# EAGLE design ledlamp (EAGLE 6.5.0)
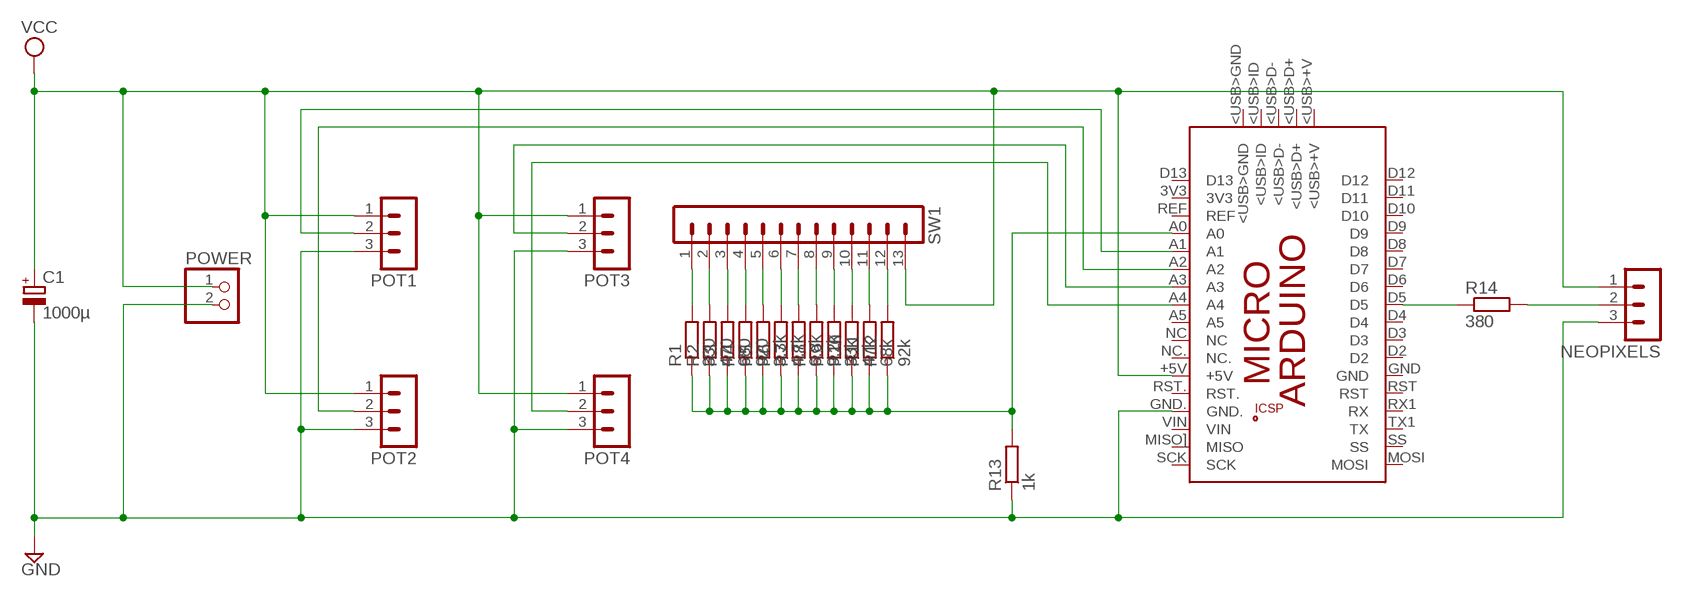
[diagram p0: schematic, sheet 1]

## Parts
C1  1000µ  CPOL-EUE5-8.5  [E5-8,5]
NEOPIXELS  MA03-1  [MA03-1]
PCB1  ARDUINO_MICRO  [ARDUINO_MICRO]
POT1  MA03-1  [MA03-1]
POT2  MA03-1  [MA03-1]
POT3  MA03-1  [MA03-1]
POT4  MA03-1  [MA03-1]
POWER  PINHD-1X2  [1X02]
R1  330  R-EU_0207/10  [0207/10]
R2  470  R-EU_0207/10  [0207/10]
R3  680  R-EU_0207/10  [0207/10]
R4  920  R-EU_0207/10  [0207/10]
R5  3.3k  R-EU_0207/10  [0207/10]
R6  4.7k  R-EU_0207/10  [0207/10]
R7  6.8k  R-EU_0207/10  [0207/10]
R8  9.2k  R-EU_0207/10  [0207/10]
R9  33k  R-EU_0207/10  [0207/10]
R10  47k  R-EU_0207/10  [0207/10]
R11  68k  R-EU_0207/10  [0207/10]
R12  92k  R-EU_0207/10  [0207/10]
R13  1k  R-EU_0207/10  [0207/10]
R14  380  R-EU_0207/10  [0207/10]
SW1  MA13-1  [MA13-1]

## Nets
GND: C1.- NEOPIXELS.3 PCB1.GND. POT1.3 POT2.3 POT3.3 POT4.3 POWER.2 R13.1
N$2: R1.2 SW1.1
N$3: R2.2 SW1.2
N$4: R3.2 SW1.3
N$5: R4.2 SW1.4
N$6: R5.2 SW1.5
N$7: R6.2 SW1.6
N$8: R7.2 SW1.7
N$9: R8.2 SW1.8
N$10: R9.2 SW1.9
N$11: R10.2 SW1.10
N$12: R11.2 SW1.11
N$13: R12.2 SW1.12
N$14: PCB1.A0 R1.1 R2.1 R3.1 R4.1 R5.1 R6.1 R7.1 R8.1 R9.1 R10.1 R11.1 R12.1 R13.2
N$18: PCB1.A1 POT1.2
N$19: PCB1.A2 POT2.2
N$20: PCB1.A3 POT3.2
N$21: PCB1.A4 POT4.2
N$22: PCB1.D5 R14.1
N$23: NEOPIXELS.2 R14.2
VCC: C1.+ NEOPIXELS.1 PCB1.+5V POT1.1 POT2.1 POT3.1 POT4.1 POWER.1 SW1.13
Unconnected: PCB1.3V3 PCB1.5V PCB1.<USB>+V PCB1.<USB>D+ PCB1.<USB>D- PCB1.<USB>GND PCB1.<USB>ID PCB1.A5 PCB1.D2 PCB1.D3 PCB1.D4 PCB1.D6 PCB1.D7 PCB1.D8 PCB1.D9 PCB1.D10 PCB1.D11 PCB1.D12 PCB1.D13 PCB1.GND PCB1.GND_ PCB1.MISO. PCB1.MISO](MISO) PCB1.MOSI PCB1.MOSI. PCB1.NC PCB1.NC. PCB1.REF PCB1.RESET.. PCB1.RST PCB1.RST. PCB1.RX1(RX) PCB1.SCK PCB1.SCK. PCB1.SS PCB1.TX1(TX) PCB1.VIN

## Library data of the parts
C1 = rcl:CPOL-EU: POLARIZED CAPACITOR, European symbol
NEOPIXELS POT1-POT4 = con-lstb:MA03-1: PIN HEADER; OC_FARNELL: unknown; OC_NEWARK: unknown
PCB1 = E14_Arduino_revB:ARDUINO_MICRO: Device for representing an Arduino Micro board with a footprint in an EAGLE design. Created by Dave Young for Element14. More EAGLE documentation at: http://www.element14.com/community/community/knode/cadsoft_eagle
POWER = pinhead:PINHD-1X2: PIN HEADER
R1-R14 = rcl:R-EU_: RESISTOR, European symbol
SW1 = con-lstb:MA13-1: PIN HEADER; OC_FARNELL: unknown; OC_NEWARK: unknown

## Board
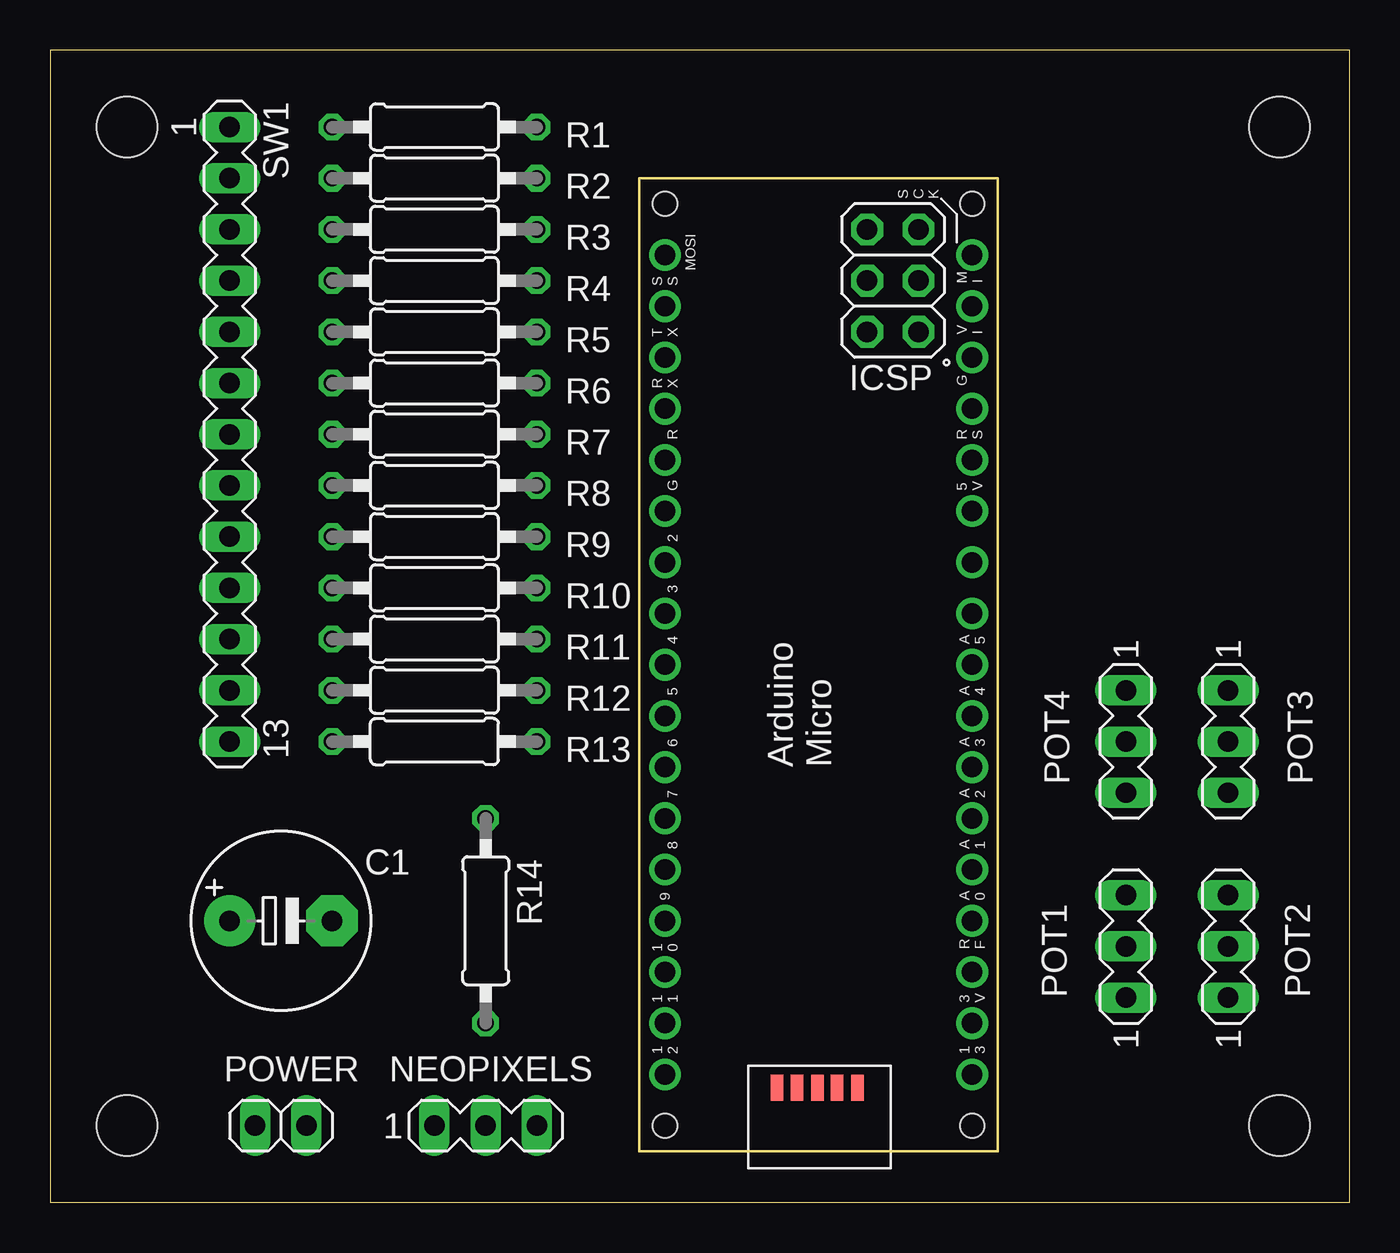
[diagram p1: board, top side]
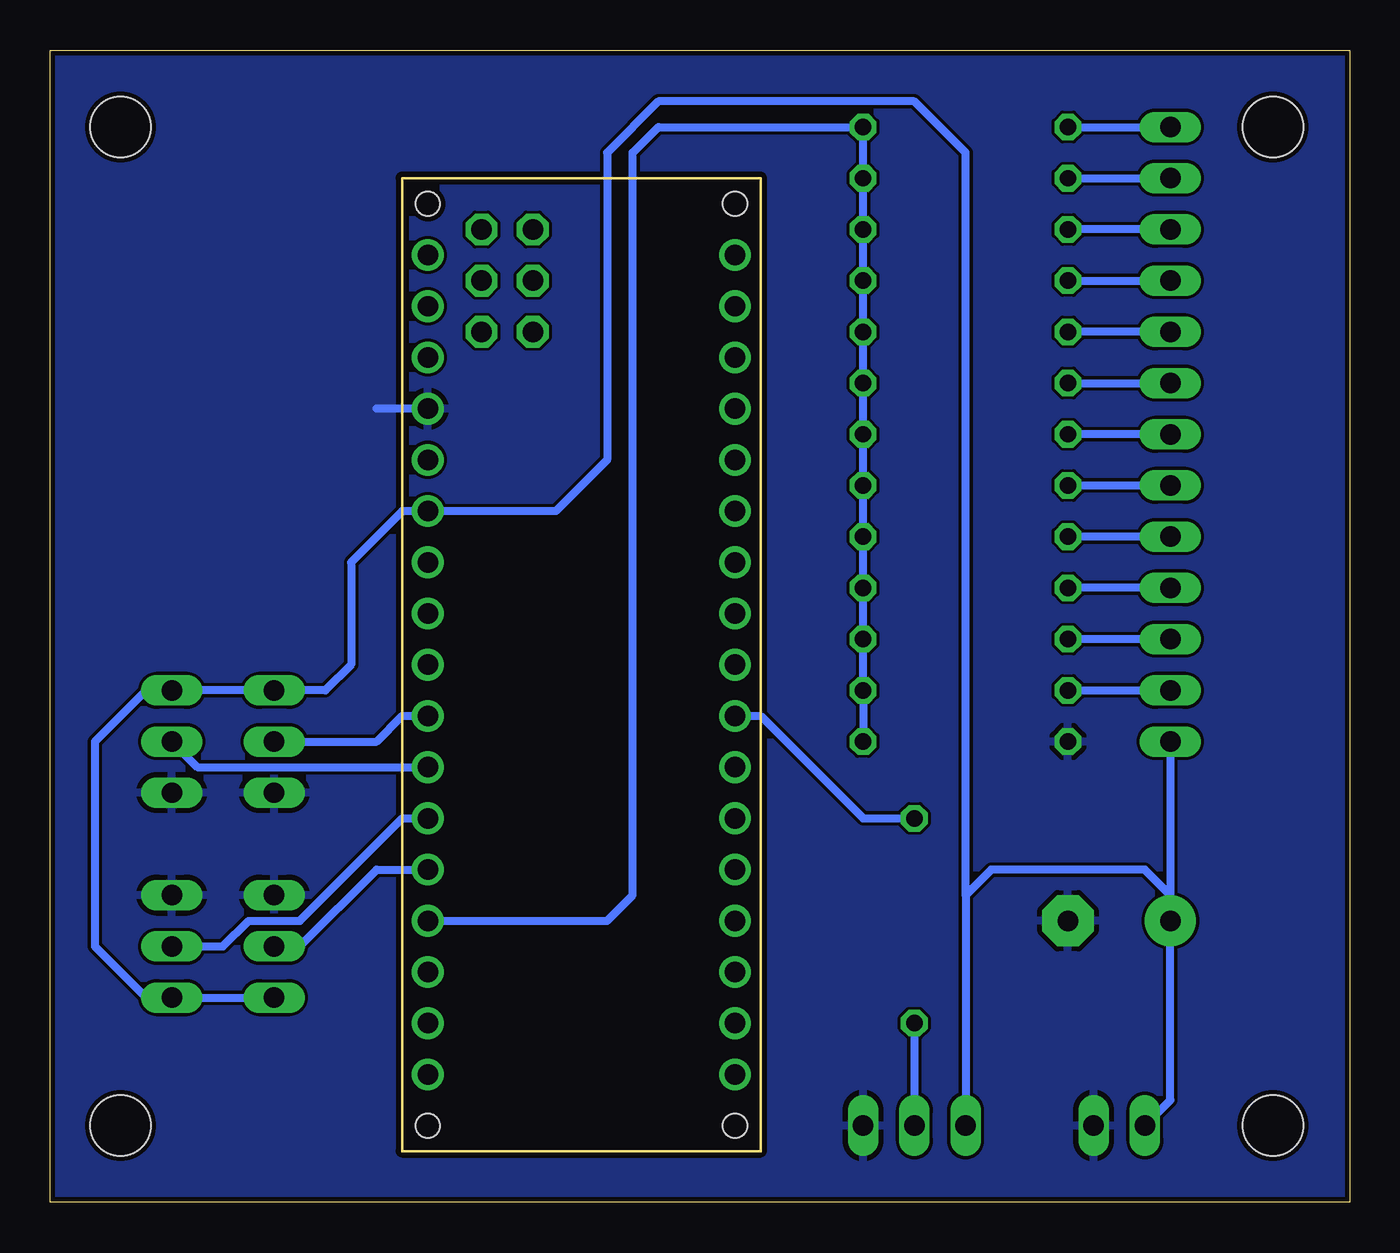
[diagram p2: board, bottom side, seen from below]

Size 64.44 x 57.14 mm. Coordinates in mm from the lower left corner, seen from the top.
Outline: 0,0 64.44,0 64.44,57.14 0,57.14 0,0
Copper layers (1*16): Top 0.035mm / dielectric 1.5mm / Bottom 0.035mm
Design rules "SeeedStudio_2layer_DRU_no_angle_20140221": minimum track width 6mil, minimum drill 12mil, track to track 6mil, track to pad 6mil, pad to pad 6mil, via to via 6mil, smd to smd 0mil, copper to edge 10mil, drill to drill 10mil, minimum pad ring 10mil, minimum via ring 6mil, stop-mask expansion 2mil, vias tented up to drill 100mil, thermal gap 10mil
Holes 3 mm at 3.81,53.34 3.81,3.81 60.96,3.81 60.96,53.34

### Footprints (pad centres in the part's own frame; a part is rotated, then mirrored left to right if it is on the bottom)
E5-8,5 = drill 1.016 pad 2.54: + -2.54,0 | drill 1.016 pad 2.54 octagon: - 2.54,0
MA03-1 = drill 1.016 long: 1 -2.54,0; 2 0,0; 3 2.54,0
ARDUINO_MICRO = drill 1.016 pad 1.575: 3V3 6.35,1.27; +5V 31.75,1.27; A0 11.43,1.27; A1 13.97,1.27; A2 16.51,1.27; A3 19.05,1.27; A4 21.59,1.27; A5 24.13,1.27; D2 29.21,16.51; D3 26.67,16.51; D4 24.13,16.51; D5 21.59,16.51; D6 19.05,16.51; D7 16.51,16.51; D8 13.97,16.51; D9 11.43,16.51; D10 8.89,16.51; D11 6.35,16.51; D12 3.81,16.51; D13 3.81,1.27; GND 31.75,16.51; GND. 36.83,1.27; MISO] 41.91,1.27; MOSI 44.45,16.51; NC 26.67,1.27; NC. 29.21,1.27; REF 8.89,1.27; RST 34.29,16.51; RST. 34.29,1.27; RX1 36.83,16.51; SCK 44.45,1.27; SS 41.91,16.51; TX1 39.37,16.51; VIN 39.37,1.27 | drill 1.016 pad 1.575 octagon: 5V 40.64,6.477; GND_ 45.72,6.477; MISO. 40.64,3.937; MOSI. 43.18,6.477; RESET.. 45.72,3.937; SCK. 43.18,3.937 | smd 1.27 x 0.635: <USB>+V 3.15,10.947; <USB>D+ 3.15,9.957; <USB>D- 3.15,8.941; <USB>GND 3.15,6.96; <USB>ID 3.15,7.976 | hole 1.2: 1.27,1.27; 1.27,16.51; 46.99,16.51; 46.99,1.27
1X02 = drill 1.016 long: 1 -1.27,0; 2 1.27,0
0207/10 = drill 0.813 octagon: 1 -5.08,0; 2 5.08,0
MA13-1 = drill 1.016 long: 1 -15.24,0; 2 -12.7,0; 3 -10.16,0; 4 -7.62,0; 5 -5.08,0; 6 -2.54,0; 7 0,0; 8 2.54,0; 9 5.08,0; 10 7.62,0; 11 10.16,0; 12 12.7,0; 13 15.24,0

### Placement (x,y rotation side)
C1  11.43,13.97 0 top
NEOPIXELS  21.59,3.81 0 top
PCB1  46.99,2.54 90 top
POT1  53.34,12.7 90 top
POT2  58.42,12.7 90 top
POT3  58.42,22.86 270 top
POT4  53.34,22.86 270 top
POWER  11.43,3.81 0 top
R1  19.05,53.34 180 top
R2  19.05,50.8 180 top
R3  19.05,48.26 180 top
R4  19.05,45.72 180 top
R5  19.05,43.18 180 top
R6  19.05,40.64 180 top
R7  19.05,38.1 180 top
R8  19.05,35.56 180 top
R9  19.05,33.02 180 top
R10  19.05,30.48 180 top
R11  19.05,27.94 180 top
R12  19.05,25.4 180 top
R13  19.05,22.86 0 top
R14  21.59,13.97 270 top
SW1  8.89,38.1 270 top

### Tracks (layer width: path | path; a pad name or v marks a point on that pad's centre or on a via)
GND
  Bottom 0.406: PCB1.GND. 48.26,39.37
  pour Bottom: 0,0 0,57.15 64.77,57.15 64.77,0
N$2
  Bottom 0.406: R1.2 SW1.1
N$3
  Bottom 0.406: R2.2 SW1.2
N$4
  Bottom 0.406: SW1.3 R3.2
N$5
  Bottom 0.406: R4.2 SW1.4
N$6
  Bottom 0.406: SW1.5 R5.2
N$7
  Bottom 0.406: R6.2 SW1.6
N$8
  Bottom 0.406: SW1.7 R7.2
N$9
  Bottom 0.406: R8.2 SW1.8
N$10
  Bottom 0.406: SW1.9 R9.2
N$11
  Bottom 0.406: SW1.10 R10.2
N$12
  Bottom 0.406: SW1.11 R11.2
N$13
  Bottom 0.406: R12.2 SW1.12
N$14
  Bottom 0.406: PCB1.A0 36.83,13.97 35.56,15.24 35.56,52.07 34.29,53.34 R1.1 R2.1 R3.1 R4.1 R5.1 R6.1 R7.1 R8.1 R9.1 R10.1 R11.1 R12.1 R13.2
N$18
  Bottom 0.406: POT1.2 52.07,12.7 48.26,16.51 PCB1.A1
N$19
  Bottom 0.406: POT2.2 55.88,12.7 54.61,13.97 52.07,13.97 46.99,19.05 PCB1.A2
N$20
  Bottom 0.406: POT3.2 57.15,21.59 PCB1.A3
N$21
  Bottom 0.406: POT4.2 48.26,22.86 46.99,24.13 PCB1.A4
N$22
  Bottom 0.406: PCB1.D5 29.21,24.13 24.13,19.05 R14.1
N$23
  Bottom 0.406: R14.2 NEOPIXELS.2
VCC
  Bottom 0.406: POWER.1 8.89,5.08 C1.+ 8.89,15.24 | 8.89,15.24 10.16,16.51 17.78,16.51 19.05,15.24 | 19.05,15.24 NEOPIXELS.1 | 19.05,15.24 19.05,52.07 21.59,54.61 34.29,54.61 36.83,52.07 36.83,36.83 39.37,34.29 PCB1.+5V 46.99,34.29 49.53,31.75 49.53,26.67 50.8,25.4 POT4.1 POT3.1 59.69,25.4 62.23,22.86 62.23,12.7 59.69,10.16 POT2.1 POT1.1 | SW1.13 8.89,15.24